# Altium project TPS54331 MOUDLE.PrjPcb
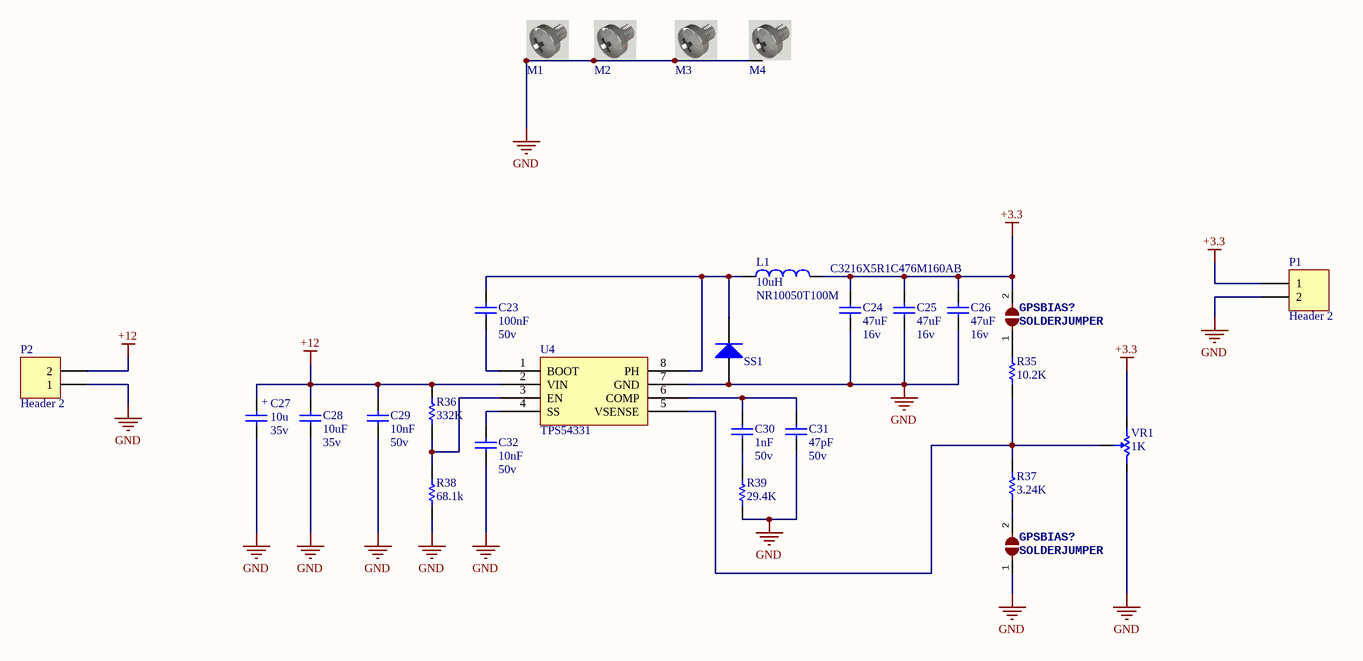
[diagram p0: TPS54331.SchDoc]
1 sheet, 27 parts. Net scope: global (net labels, ports and power ports of the same name join across sheets).
Board file: TPS54331 MOUDLE.PcbDoc

## Sheet TPS54331.SchDoc: Design 1
size Tabloid; Engineer: The ASID Designer; Organization: ASID Designer; Address1: Iran; Address2: Shiraz; Address3: P.O.Box 71765-385; DocumentNumber: 1; Revision: 1.0; SheetNumber: 1; SheetTotal: 1

### Parts
(Parts that share a designator on the sheet are numbered #1, #2 ... from top to bottom, then left to right.)
C23  Volte: 50v  [MY_0805]  (hidden comment: 100nF)
C24  C3216X5R1C476M160AB  value 47uF  Volte: 16v  [MY_1210]
C25  Volte: 16v  [MY_1210]  (hidden comment: 47uF)
C26  Volte: 16v  [MY_1210]  (hidden comment: 47uF)
C27  Volte: 35v  [MY_SMC_D]  (hidden comment: 10u)
C28  Volte: 35v  [MY_1206]  (hidden comment: 10uF)
C29  Volte: 50v  [CAP 1206 (3216X15L)]  (hidden comment: 10nF)
C30  Volte: 50v  [MY_0805]  (hidden comment: 1nF)
C31  Volte: 50v  [MY_0805]  (hidden comment: 47pF)
C32  Volte: 50v  [MY_0805]  (hidden comment: 10nF)
GPSBIAS?#1  SOLDERJUMPER  [SOLDERJUMPER_ARROW_NOPASTE]
GPSBIAS?#2  SOLDERJUMPER  [SOLDERJUMPER_ARROW_NOPASTE]
L1  NR10050T100M  value 10uH  [MY_DR1030]
M1  Screw  [Board Screw]  (value not drawn)
M2  Screw  [Board Screw]  (value not drawn)
M3  Screw  [Board Screw]  (value not drawn)
M4  Screw  [Board Screw]  (value not drawn)
P1  Header 2  [HDR1X2]
P2  Header 2  [HDR1X2]
R35  10.2K  [MY_0805]
R36  332K  [MY_0805]
R37  3.24K  [MY_0805]
R38  68.1k  [MY_0805]
R39  29.4K  [MY_0805]
SS1  shot key  [Diode smd]  (value not drawn)
U4  TPS54331  [SOIC8_M]
VR1  1K  [Multi Turn 02]

### Nets
+3.3: C24.2 C25.2 C26.2 GPSBIAS?#1.2 L1.2 P1.1 VR1.2(CW)
+12: C27.+ C28.2 C29.2 P2.2 R36.1 U4.2(VIN)
GND: C24.1 C25.1 C26.1 C27.- C28.1 C29.1 C31.1 C32.1 GPSBIAS?#2.1 M1.S M2.S M3.S M4.S P1.2 P2.1 R38.2 R39.2 SS1.0(A) U4.7(GND) VR1.1(CCW)
NetC23_1: C23.1 U4.1(BOOT)
NetC23_2: C23.2 L1.1 SS1.1(K) U4.8(PH)
NetC30_1: C30.1 R39.1
NetC30_2: C30.2 C31.2 U4.6(COMP)
NetC32_2: C32.2 U4.4(SS)
NetGPSBIAS?#1_1: GPSBIAS?#1.1 R35.1
NetGPSBIAS?#2_2: GPSBIAS?#2.2 R37.2
NetR35_2: R35.2 R37.1 U4.5(VSENSE) VR1.3(Setpoint)
NetR36_2: R36.2 R38.1 U4.3(EN)

### Notes on the sheet
- Title
- Engineer:
- Date:
- Ali Asadzadeh
- Time:
- Number:
- Sheet
- Revision:
- of
- www.ASiDesigner.com
- Designed In Shiraz
- ASiD Designer
- File:

### Library data of the parts
C23-C26 C28-C32 = Cap ceramic: None polar capacitor
  C23: Value: 100nF
  C25 C26: Value: 47uF
  C28: Value: 10uF
  C29 C32: Value: 10nF
  C30: Value: 1nF
  C31: Value: 47pF
C27 = Cap Pol: Polar capacitor; ASiD Part Number: C-AS; Value: 10u
GPSBIAS?#1 GPSBIAS?#2 = SOLDERJUMPER: SMD Solder JUMPER   Solder the two pads together to create a connection, or remove the solder to break it.REFLOW - Use this footprint for solder paste and reflow ovens. WAVE - Use this footprint for hand-soldering (larger pads).    CLOSED - Has a trace between the two pads to ensure it is closed by default.  The trace needs to be cut to disable the jumper, and can be closed again by creating a solder bridge between the two pads.; BOM: EXCLUDE; COMPANY: ADAFRUIT INDUSTRIES; DRAWN: KTOWN; REV: A
L1 = Inductor: Current: 4.7A
M1-M4 = Board Screw: Board Screw With Spacer
P1 P2 = Header 2: Header, 2-Pin; LatestRevisionDate: 17-Jul-2002; LatestRevisionNote: Re-released for DXP Platform.; Publisher: Altium Limited
R35-R39 = Res: Standard resistor
  R35: Value: 10.2K
  R36: Value: 332K
  R37: Value: 3.24K
  R38: Value: 68.1k
  R39: Value: 29.4K
SS1 = Diode smd
U4 = TPS54331: 3A, 28V INPUT, STEP DOWN SWIFT™ DC/DC CONVERTER WITH ECO-MODE
VR1 = Resistor Variable: Variable Resistor; Designer: Saeid Jorablo; Company: ControTec; Adding Date: 137/12/22; Value: 1K